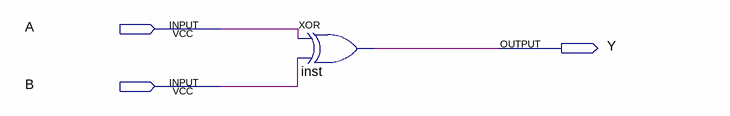
[diagram p0: schematic sheet]
// Quartus schematic Block1.bdf as structural Verilog: 1 symbols, 3 pins
module Block1 (
  input  A,
  input  B,
  output Y
);

  xor inst (Y, A, B);
endmodule
